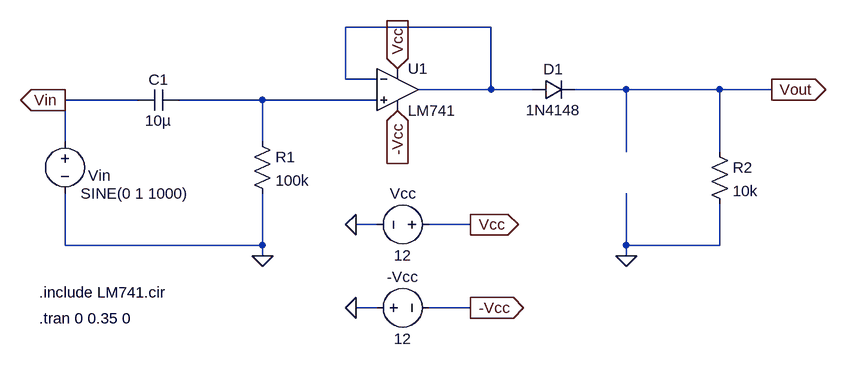
[diagram p0: schematic retificador-com-filtragem.asc]
retificador-com-filtragem.asc, the LTspice schematic file:
Version 4
SHEET 1 1696 680
WIRE 0 -80 -224 -80
WIRE -224 0 -224 -80
WIRE -176 0 -224 0
WIRE 0 16 0 -80
WIRE 0 16 -112 16
WIRE 64 16 0 16
WIRE 208 16 128 16
WIRE 352 16 208 16
WIRE 432 16 352 16
WIRE -544 32 -656 32
WIRE -352 32 -480 32
WIRE -176 32 -352 32
WIRE -656 96 -656 32
WIRE -352 96 -352 32
WIRE 208 112 208 16
WIRE 352 112 352 16
WIRE -176 224 -208 224
WIRE -32 224 -96 224
WIRE -656 256 -656 176
WIRE -352 256 -352 176
WIRE -352 256 -656 256
WIRE 208 256 208 176
WIRE 352 256 352 192
WIRE 352 256 208 256
WIRE -352 272 -352 256
WIRE 208 272 208 256
WIRE -176 352 -208 352
WIRE -32 352 -96 352
FLAG -352 272 0
FLAG -144 -16 Vcc
IOPIN -144 -16 In
FLAG -144 48 -Vcc
IOPIN -144 48 In
FLAG 208 272 0
FLAG 432 16 Vout
IOPIN 432 16 Out
FLAG -656 32 Vin
IOPIN -656 32 Out
FLAG -208 224 0
FLAG -32 224 Vcc
IOPIN -32 224 Out
FLAG -32 352 -Vcc
IOPIN -32 352 Out
FLAG -208 352 0
SYMBOL voltage -656 80 R0
WINDOW 0 36 68 Left 2
WINDOW 123 0 0 Left 0
WINDOW 39 0 0 Left 0
SYMATTR InstName Vin
SYMATTR Value SINE(0 1 1000)
SYMBOL cap -480 16 R90
WINDOW 0 0 32 VBottom 2
WINDOW 3 32 32 VTop 2
SYMATTR InstName C1
SYMATTR Value 10µ
SYMBOL res -368 80 R0
SYMATTR InstName R1
SYMATTR Value 100k
SYMBOL OpAmps\\opamp2 -144 -48 R0
SYMATTR InstName U1
SYMATTR Value LM741
SYMBOL diode 64 32 R270
WINDOW 0 32 32 VTop 2
WINDOW 3 0 32 VBottom 2
SYMATTR InstName D1
SYMATTR Value 1N4148
SYMBOL res 336 96 R0
SYMATTR InstName R2
SYMATTR Value 10k
SYMBOL voltage -80 224 R90
WINDOW 0 -32 56 VBottom 2
WINDOW 3 32 56 VTop 2
SYMATTR InstName Vcc
SYMATTR Value 12
SYMBOL voltage -192 352 R270
WINDOW 0 32 56 VTop 2
WINDOW 3 -32 56 VBottom 2
SYMATTR InstName -Vcc
SYMATTR Value 12
TEXT -696 328 Left 2 !.include LM741.cir
TEXT -696 368 Left 2 !.tran 0 0.35 0

The netlist it stands for:
* retificador-com-filtragem.asc
Vin Vin 0 SINE(0 1 1000)
C1 N002 Vin 10µ
R1 N002 0 100k
XU1 N002 N001 Vcc -Vcc N001 LM741  ; pins In+ In- V+ V- OUT
D1 N001 Vout 1N4148
R2 Vout 0 10k
Vcc Vcc 0 12
V§-Vcc 0 -Vcc 12
.model D D
.lib standard.dio
.include LM741.cir
.tran 0 0.35 0
.backanno
.end